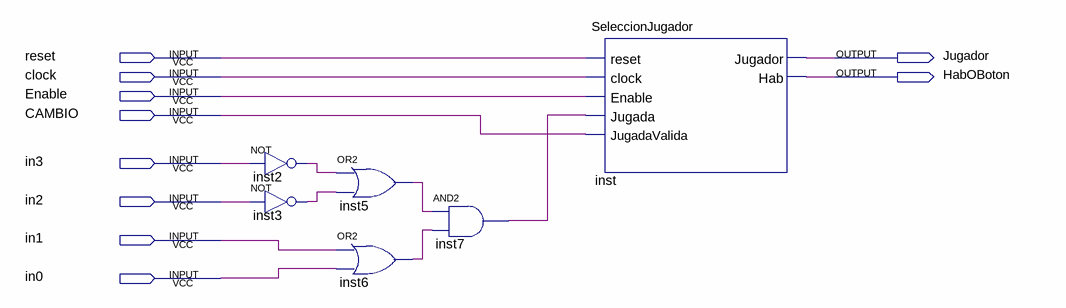
[diagram p0: schematic sheet]
// Quartus schematic ModuloSeleccionJugador.bdf as structural Verilog: 6 symbols, 10 pins
module ModuloSeleccionJugador (
  input  reset,
  input  clock,
  input  Enable,
  input  CAMBIO,
  input  in3,
  input  in2,
  input  in1,
  input  in0,
  output Jugador,
  output HabOBoton
);

  wire inst2_out, inst3_out, inst5_out, inst6_out, inst7_out;

  not inst2 (inst2_out, in3);
  not inst3 (inst3_out, in2);
  or inst5 (inst5_out, inst2_out, inst3_out);
  or inst6 (inst6_out, in1, in0);
  and inst7 (inst7_out, inst5_out, inst6_out);
  SeleccionJugador inst (
    .reset(reset), .clock(clock), .Enable(Enable), .Jugada(inst7_out), .JugadaValida(CAMBIO),
    .Jugador(Jugador), .Hab(HabOBoton));
endmodule
